# Altium project eps2_project.prjpcb (part 5 of 9)

## Sheet 7_dc_dc_3v3_eps_ttc.schdoc: EPS/Beacon Step-Down Converter (3V3/2A)
size A4; Designed by: Andre M. P. Mattos; ProjectRevision: v0.3; Organization: UFSC; DocumentNumber: 9; Revision: v0.3; SheetNumber: 9; SheetTotal: 11
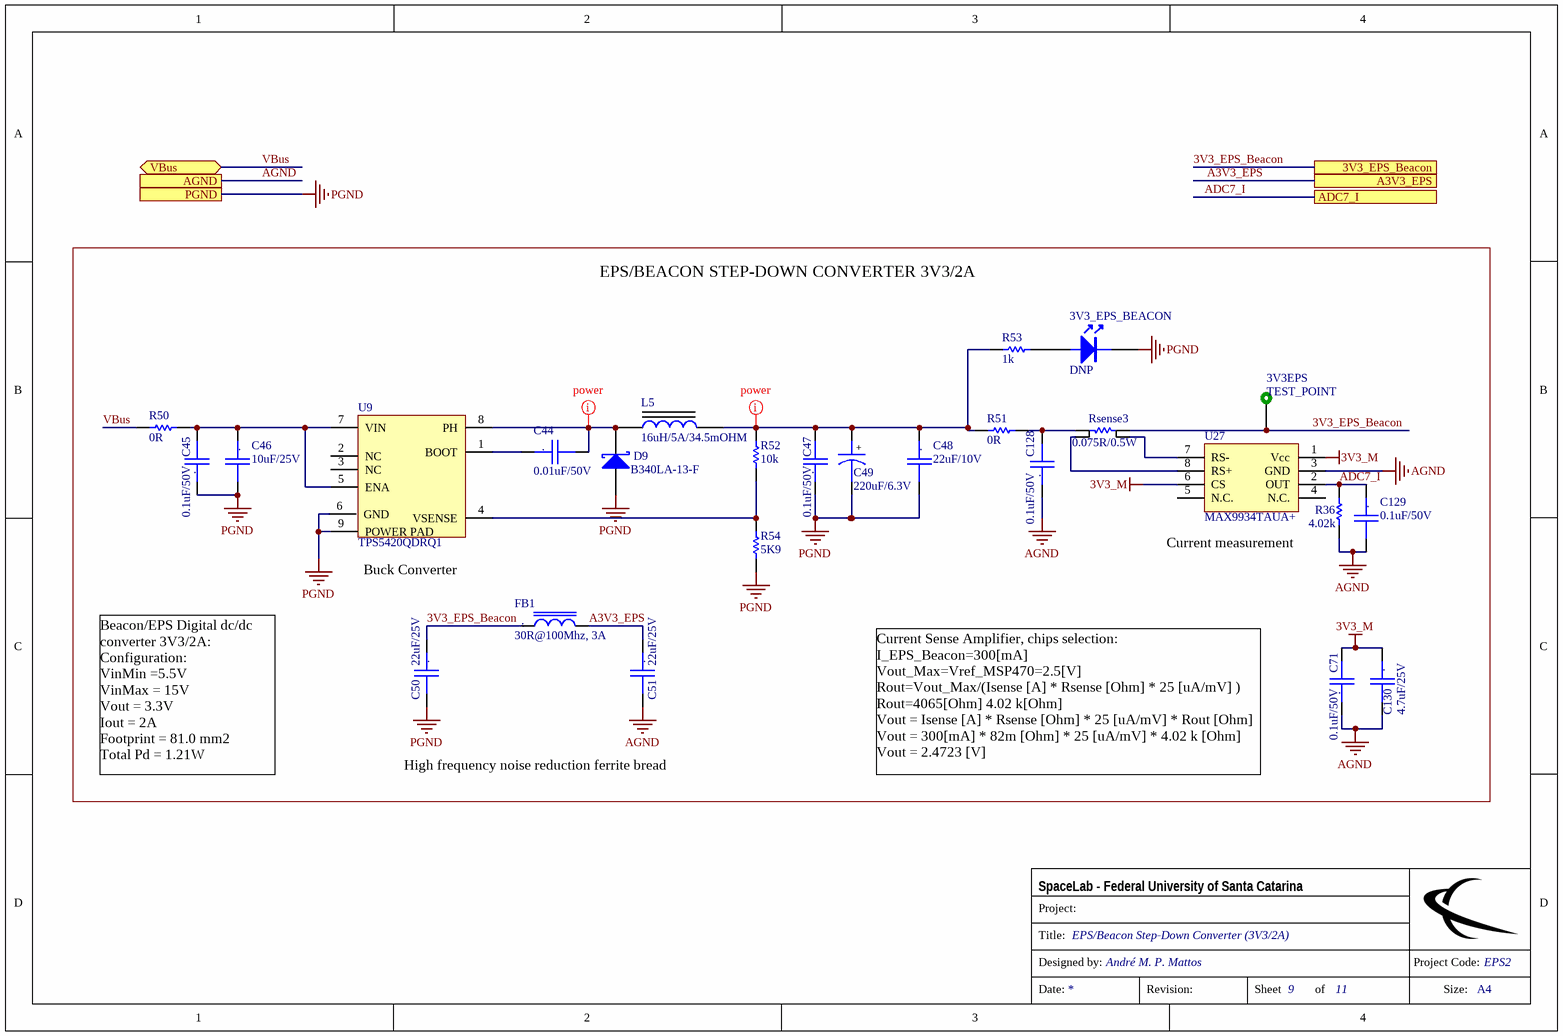
[diagram p6: 7_dc_dc_3v3_eps_ttc.schdoc]

### Parts
3V3_EPS_BEACON  DNP  [0603-LED]
3V3EPS  TEST_POINT  [TEST_POINT]  (no BOM)
C44  0.01uF/50V  [CC0805]
C45  0.1uF/50V  [CC0805]
C46  10uF/25V  [CC1206]
C47  0.1uF/50V  [CC0805]
C48  22uF/10V  [CC1206]
C49  220uF/6.3V  [cc1210]
C50  22uF/25V  [CC1210]
C51  22uF/25V  [CC1210]
C71  0.1uF/50V  [CC0603]
C128  0.1uF/50V  [CC0603]
C129  0.1uF/50V  [CC0603]
C130  4.7uF/25V  [CC0805]
D9  B340LA-13-F  [DO-214AC]
FB1  30R@100Mhz, 3A  [IND0805]
L5  16uH/5A/34.5mOHM  [IND_744325xxx]
R36  4.02k  [0805]
R50  0R  [1206]
R51  0R  [1206]
R52  10k  [0805]
R53  1k  [0603]
R54  5K9  [0805]
Rsense3  0.075R/0.5W  [1206 - ohmite]
U9  TPS5420QDRQ1  [SO8 Power PAD]
U27  MAX9934TAUA+  [MSOP-8]

### Ports
3V3_EPS_Beacon, A3V3_EPS, ADC7_I, AGND, PGND, VBus (bidir)

### Nets
3V3_EPS_Beacon: 3V3EPS.1 C50.1 FB1.1 Rsense3.2 ; port 3V3_EPS_Beacon
3V3_M: C71.2 C130.1 U27.1(Vcc) U27.6(CS)
A3V3_EPS: C51.1 FB1.2 ; port A3V3_EPS
AGND: C51.2 C71.1 C128.1 C129.2 C130.2 R36.1 U27.3(GND) ; port AGND
PGND: 3V3_EPS_BEACON.2(K) C45.1 C46.2 C47.1 C48.2 C49.2 C50.2 D9.2(A) R54.1 U9.6(GND) U9.9(POWER_PAD) ; port PGND
ADC7_I: C129.1 R36.2 U27.2(OUT) ; port ADC7_I
VBus: R50.2 ; port VBus
Net3V3_EPS_BEACON_1: 3V3_EPS_BEACON.1(A) R53.1
NetC44_1: C44.1 U9.1(BOOT)
NetC44_2: C44.2 D9.1(K) L5.1 U9.8(PH)
NetC45_2: C45.2 C46.1 R50.1 U9.5(ENA) U9.7(VIN)
NetC47_2: C47.2 C48.1 C49.1 L5.2 R51.2 R52.2 R53.2
NetC128_2: C128.2 R51.1 Rsense3.1
NetR52_1: R52.1 R54.2 U9.4(VSENSE)
NetRsense3_3: Rsense3.3 U27.8(RS+)
NetRsense3_4: Rsense3.4 U27.7(RS-)

Not connected (* = marked no-connect by the designer): U9 2(NC) 3(NC); U27 4(N.C.) 5(N.C.)

### Layout directives
net class power: NetC44_2, NetC47_2

### Notes on the sheet
- EPS/BEACON STEP-DOWN CONVERTER 3V3/2A
- (near U9) Buck Converter
- Current measurement
- Beacon/EPS Digital dc/dc converter 3V3/2A:
  Configuration:
  VinMin =5.5V
  VinMax = 15V
  Vout = 3.3V
  Iout = 2A
  Footprint = 81.0 mm2
  Total Pd = 1.21W
- High frequency noise reduction ferrite bread
- Current Sense Amplifier, chips selection:
  I_EPS_Beacon=300[mA]
  Vout_Max=Vref_MSP470=2.5[V]
  Rout=Vout_Max/(Isense [A] * Rsense [Ohm] * 25 [uA/mV] )
  Rout=4065[Ohm] 4.02 k[Ohm]
  Vout = Isense [A] * Rsense [Ohm] * 25 [uA/mV] * Rout [Ohm]
  Vout = 300[mA] * 82m [Ohm] * 25 [uA/mV] * 4.02 k [Ohm]
  Vout = 2.4723 [V]
- Project:
- SpaceLab - Federal University of Santa Catarina
- Title:
- Designed by:
- Project Code:
- Date:
- Revision:
- Sheet
- of
- Size:
- A4
- (in symbol Cap_Cer_X7R_0.1uF_50V_0603) .
- (in symbol Cap_Cer_X7R_0.01uF_50V_0805) .
- (in symbol Cap_Cer_X7R_0.1uF_50V_0805) .
- (in symbol Cap_Cer_X7R_4.7uF_25V_0805) .
- (in symbol Cap_Cer_X7R_10uF_25V_1206) .
- (in symbol Cap_Cer_X7R_22uF_10V_1206) .
- (in symbol Cap_Cer_X7R_22uF_25V_1210) .
- (in symbol Cap_Tant_SMD_220uF_6.3V_1210) +
- (in symbol FB_30R_3A_100MHz_0805) .

### Library data of the parts
3V3_EPS_BEACON = LED/G_0603: SMD Green LED; Partnumber: 150060VS75000; Manufacturer: Wurth Electronics; Dominant Wavelength: 570nm; Forward Current: 30mA; Forward Voltage: 2V; Lens Style: Clear,Rectangular; Luminous Intensity: 40mcd; Test Current: 20mA; Viewing Angle: 140°; NCM: 8541.40.21; Case/Package: 0603; Case Code (Imperial): 0603; Case Code (Metric): 1608; Color: Green; ComponentLink1Description: https://katalog.we-online.de/led/datasheet/150060VS75000.pdf?src-supplier=Digi-Key; ComponentLink1URL: https://katalog.we-online.de/led/datasheet/150060VS75000.pdf?src-supplier=Digi-Key; Height: 0.7mm; Length: 1.6mm; Manufacturer Part Number: 150060VS75000; Max Operating Temperature: 85°C; Min Operating Temperature: -40°C; Mount: Surface Mount; Number of Pins: 2; Package Quantity: 1; Packaging: Tape and Reel; Pricing 1: 1=0.14, 10=0.138, 25=0.138, 50=0.129, 100=0.11, 250=0.11 (USD); Pricing 2: 1=0.14, 50=0.133, 100=0.114, 500=0.099 (USD); REACH SVHC: Unknown; Stock 1: 16336; Stock 2: 31910; Supplier 1: Mouser; Supplier 2: Digi-Key; Supplier Part Number 1: 710-150060VS75000; Supplier Part Number 2: 732-4980-1-ND; Wavelength: 570nm; Width: 0.8mm
3V3EPS = TEST_POINT: Test point
C44 = Cap_Cer_X7R_0.01uF_50V_0805: CAP CER 0.01uF 50V 10% X7R 0805; Partnumber: 08055C103KAT4A; Manufacturer: Kyocera AVX; Capacitance: 10nF; NCM: 8532.24.10; Case/Package: 0805; Case Code (Imperial): 0805; Case Code (Metric): 2012; ComponentLink1Description: http://www.mouser.com/ds/2/40/X7RDielectric-777024.pdf?src-supplier=Mouser; ComponentLink1URL: http://www.mouser.com/ds/2/40/X7RDielectric-777024.pdf?src-supplier=Mouser; ComponentLink2Description: http://www.avx.com/docs/Catalogs/cx7r.pdf?src-supplier=Future+Electronics; ComponentLink2URL: http://www.avx.com/docs/Catalogs/cx7r.pdf?src-supplier=Future+Electronics; Depth: 1.25mm; Dielectric: X7R; Height: 0.94mm; Lead Free: Lead Free; Length: 2.01mm; Manufacturer Part Number: 08055C103KAT4A; Max Operating Temperature: 125°C; Min Operating Temperature: -55°C; Mount: Surface Mount; Number of Pins: 2; Packaging: Tape and Reel; Pricing 1: 1=0.12, 10=0.085, 100=0.04, 500=0.028, 1000=0.023, 2500=0.018 (USD); Pricing 2: 1=0.13, 10=0.09, 50=0.0508, 100=0.0421, 500=0.02952, 1000=0.02444, 2500=0.02275, 5000=0.02081 (USD); Radiation Hardening: No; Stock 1: 88198; Stock 2: 515319; Supplier 1: Mouser; Supplier 2: Digi-Key; Supplier Part Number 1: 581-08055C103KAT4A; Supplier Part Number 2: 478-10687-1-ND; Termination: SMD/SMT; Tolerance: 10%; Voltage: 50V; Voltage Rating (DC): 50V; Voltage Rating: 50V; Weight: 0.000194oz; Width: 1.25mm
C45 C47 = Cap_Cer_X7R_0.1uF_50V_0805: CAP CER 0.1UF 50V 10% X7R 0805; Partnumber: CC0805KRX7R9BB104; Manufacturer: Yageo; Capacitance: 100nF; Insulation Resistance: 100GR; Material: Ceramic; Case/Package: 0805; Case Code (Imperial): 0805; Case Code (Metric): 2012; ComponentLink1Description: http://www.yageo.com/documents/recent/UPY-GPHC_X7R_6.3V-to-50V_8.pdf?src-supplier=Avnet; ComponentLink1URL: http://www.yageo.com/documents/recent/UPY-GPHC_X7R_6.3V-to-50V_8.pdf?src-supplier=Avnet; ComponentLink2Description: http://www.farnell.com/datasheets/1489800.pdf?src-supplier=Element14; ComponentLink2URL: http://www.farnell.com/datasheets/1489800.pdf?src-supplier=Element14; ComponentLink3Description: http://www.yageo.com/documents/recent/UPY-GPHC_X7R_6.3V-to-50V_18.pdf?src-supplier=Digi-Key; ComponentLink3URL: http://www.yageo.com/documents/recent/UPY-GPHC_X7R_6.3V-to-50V_18.pdf?src-supplier=Digi-Key; ComponentLink4Description: http://www.farnell.com/datasheets/2167236.pdf?src-supplier=Element14; ComponentLink4URL: http://www.farnell.com/datasheets/2167236.pdf?src-supplier=Element14; ComponentLink5Description: http://www.yageo.com/documents/recent/UPY-GPHC_X7R_6.3V-to-50V_8.pdf?src-supplier=Avnet+Europe; ComponentLink5URL: http://www.yageo.com/documents/recent/UPY-GPHC_X7R_6.3V-to-50V_8.pdf?src-supplier=Avnet+Europe; ComponentLink6Description: http://www.produktinfo.conrad.com/datenblaetter/425000-449999/445210-da-01-en-KERKO_CHIP_0805_X7R_0_1uF_10Proz_50VG.pdf?src-supplier=Conrad; ComponentLink6URL: http://www.produktinfo.conrad.com/datenblaetter/425000-449999/445210-da-01-en-KERKO_CHIP_0805_X7R_0_1uF_10Proz_50VG.pdf?src-supplier=Conrad; Depth: 1.25mm; Dielectric: X7R; Halogen Free: Halogen Free; Height: 0.85mm; Lead Free: Lead Free; Length: 2mm; Manufacturer Part Number: CC0805KRX7R9BB104; Max Operating Temperature: 125°C; Min Operating Temperature: -55°C; Mount: Surface Mount; Number of Pins: 2; Package Quantity: 1; Packaging: Tape and Reel; Pricing 1: 1=0.12, 10=0.087, 100=0.028, 1000=0.023, 4000=0.018, 8000=0.017 (USD); Pricing 2: 1=0.12, 10=0.088, 50=0.05, 100=0.0414, 500=0.02906, 1000=0.02405 (USD); Radiation Hardening: No; REACH SVHC: No SVHC; Stock 1: 3904445; Stock 2: 544494; Supplier 1: Mouser; Supplier 2: Digi-Key; Supplier Part Number 1: 603-CC805KRX7R9BB104; Supplier Part Number 2: 311-1140-1-ND; Termination: SMD/SMT; Thickness: 0.033inch; Tolerance: 10%; Voltage: 50V; Voltage Rating: 50V; Width: 0.049inch
C46 = Cap_Cer_X7R_10uF_25V_1206: CAP CER 10uF 25V 10% X7R 1206; Partnumber: GRM31CR71E106KA12L; Manufacturer: Murata; Material: Ceramic; NCM: 8532.24.10; Capacitance: 10uF; Case/Package: 1206; Case Code (Imperial): 1206; Case Code (Metric): 3216; ComponentLink1Description: http://www.mouser.com/ds/2/281/c02e-2905.pdf?src-supplier=Mouser; ComponentLink1URL: http://www.mouser.com/ds/2/281/c02e-2905.pdf?src-supplier=Mouser; ComponentLink2Description: http://www.farnell.com/datasheets/415311.pdf?src-supplier=Element14; ComponentLink2URL: http://www.farnell.com/datasheets/415311.pdf?src-supplier=Element14; ComponentLink3Description: http://www.farnell.com/datasheets/2048746.pdf?src-supplier=Element14; ComponentLink3URL: http://www.farnell.com/datasheets/2048746.pdf?src-supplier=Element14; ComponentLink4Description: http://uk.rs-online.com/webdocs/13d2/0900766b813d2ca8.pdf?src-supplier=RSComponents; ComponentLink4URL: http://uk.rs-online.com/webdocs/13d2/0900766b813d2ca8.pdf?src-supplier=RSComponents; ComponentLink5Description: http://search.murata.co.jp/Ceramy/image/img/A01X/partnumbering_e_01.pdf?src-supplier=Future+Electronics; ComponentLink5URL: http://search.murata.co.jp/Ceramy/image/img/A01X/partnumbering_e_01.pdf?src-supplier=Future+Electronics; ComponentLink6Description: https://www.distrelec.biz/Web/Downloads/_t/ds/murata_MLCC_eng_tds.pdf?mime=application%2Fpdf&src-supplier=Distrelec; ComponentLink6URL: https://www.distrelec.biz/Web/Downloads/_t/ds/murata_MLCC_eng_tds.pdf?mime=application%2Fpdf&src-supplier=Distrelec; ComponentLink7Description: https://www.murata.com/~/media/webrenewal/support/library/catalog/products/capacitor/mlcc/c02e.ashx?la=en-us&src-supplier=Digi-Key; ComponentLink7URL: https://www.murata.com/~/media/webrenewal/support/library/catalog/products/capacitor/mlcc/c02e.ashx?la=en-us&src-supplier=Digi-Key; ComponentLink8Description: http://components.arrow.com/part/dataview/46271255S8319800N2606?src-supplier=Arrow; ComponentLink8URL: http://components.arrow.com/part/dataview/46271255S8319800N2606?src-supplier=Arrow; ComponentLink9Description: http://www.farnell.com/datasheets/415311.pdf?src-supplier=Farnell; ComponentLink9URL: http://www.farnell.com/datasheets/415311.pdf?src-supplier=Farnell; ComponentLink10Description: http://www.produktinfo.conrad.com/datenblaetter/450000-474999/454935-da-01-en-VS_KONDENSATOR_1206.pdf?src-supplier=Conrad; ComponentLink10URL: http://www.produktinfo.conrad.com/datenblaetter/450000-474999/454935-da-01-en-VS_KONDENSATOR_1206.pdf?src-supplier=Conrad; ComponentLink11Description: http://www.produktinfo.conrad.com/datenblaetter/450000-474999/451104-da-01-de-VS_CHIP_KOND_1206_10_0_UF_10Pr_25_0V_X7R.pdf?src-supplier=Conrad; ComponentLink11URL: http://www.produktinfo.conrad.com/datenblaetter/450000-474999/451104-da-01-de-VS_CHIP_KOND_1206_10_0_UF_10Pr_25_0V_X7R.pdf?src-supplier=Conrad; Depth: 1.6mm; Dielectric: X7R; Height: 1.6mm; Lead Free: Lead Free; Length: 3.2mm; Manufacturer Part Number: GRM31CR71E106KA12L; Max Operating Temperature: 125°C; Min Operating Temperature: -55°C; Mount: Surface Mount; Number of Pins: 2; Package Quantity: 1; Packaging: Tape and Reel; Pricing 1: 1=0.83, 10=0.627, 100=0.448, 250=0.434, 500=0.347, 1000=0.299 (USD); Pricing 2: 1=0.88, 10=0.646, 50=0.517, 100=0.4431, 500=0.35082, 1000=0.29543 (USD); Radiation Hardening: No; REACH SVHC: No SVHC; Stock 1: 131052; Stock 2: 1515422; Supplier 1: Mouser; Supplier 2: Digi-Key; Supplier Part Number 1: 81-GRM31CR71E106KA12; Supplier Part Number 2: 490-6518-1-ND; Termination: SMD/SMT; Thickness: 0.071inch; Tolerance: 10%; Voltage: 25V; Voltage Rating (DC): 25V; Voltage Rating: 25V; Width: 1.6mm
C48 = Cap_Cer_X7R_22uF_10V_1206: CAP CER 22uF 10V 10% X7R 1206; Partnumber: GRM31CR71A226KE15L; Manufacturer: Murata; Material: Ceramic; NCM: 8532.24.10; Capacitance: 22uF; Case/Package: 1206; Case Code (Imperial): 1206; Case Code (Metric): 3216; ComponentLink1Description: http://components.arrow.com/part/dataview/46868660S8337524N2606?src-supplier=Arrow; ComponentLink1URL: http://components.arrow.com/part/dataview/46868660S8337524N2606?src-supplier=Arrow; ComponentLink2Description: http://uk.rs-online.com/webdocs/1423/0900766b81423c84.pdf?src-supplier=RSComponents; ComponentLink2URL: http://uk.rs-online.com/webdocs/1423/0900766b81423c84.pdf?src-supplier=RSComponents; ComponentLink3Description: https://www.murata.com/~/media/webrenewal/support/library/catalog/products/capacitor/mlcc/c02e.ashx?la=en-us&src-supplier=Digi-Key; ComponentLink3URL: https://www.murata.com/~/media/webrenewal/support/library/catalog/products/capacitor/mlcc/c02e.ashx?la=en-us&src-supplier=Digi-Key; ComponentLink4Description: http://www.farnell.com/datasheets/2048963.pdf?src-supplier=Farnell; ComponentLink4URL: http://www.farnell.com/datasheets/2048963.pdf?src-supplier=Farnell; ComponentLink5Description: http://www.farnell.com/datasheets/2048963.pdf?src-supplier=Element14; ComponentLink5URL: http://www.farnell.com/datasheets/2048963.pdf?src-supplier=Element14; ComponentLink6Description: http://psearch.en.murata.com/capacitor/product/GRM31CR71A226KE15%23.pdf?src-supplier=Avnet; ComponentLink6URL: http://psearch.en.murata.com/capacitor/product/GRM31CR71A226KE15%23.pdf?src-supplier=Avnet; ComponentLink7Description: http://psearch.murata.com/capacitor/product/GRM31CR71A226KE15%23.pdf?src-supplier=Avnet; ComponentLink7URL: http://psearch.murata.com/capacitor/product/GRM31CR71A226KE15%23.pdf?src-supplier=Avnet; ComponentLink8Description: https://www.distrelec.biz/Web/Downloads/_t/ds/murata_MLCC_eng_tds.pdf?mime=application%2Fpdf&src-supplier=Distrelec; ComponentLink8URL: https://www.distrelec.biz/Web/Downloads/_t/ds/murata_MLCC_eng_tds.pdf?mime=application%2Fpdf&src-supplier=Distrelec; ComponentLink9Description: http://psearch.murata.com/capacitor/product/GRM31CR71A226KE15%23.pdf?src-supplier=Future+Electronics; ComponentLink9URL: http://psearch.murata.com/capacitor/product/GRM31CR71A226KE15%23.pdf?src-supplier=Future+Electronics; ComponentLink10Description: http://www.produktinfo.conrad.com/datenblaetter/450000-474999/451412-da-01-de-VS_KONDENS_GRM31_CR71A_226KE15L.pdf?src-supplier=Conrad; ComponentLink10URL: http://www.produktinfo.conrad.com/datenblaetter/450000-474999/451412-da-01-de-VS_KONDENS_GRM31_CR71A_226KE15L.pdf?src-supplier=Conrad; ComponentLink11Description: http://www.produktinfo.conrad.com/datenblaetter/450000-474999/451120-da-01-de-VS_CHIP_KOND_1206_22_0_UF_10Pr_10_0V_X7R.pdf?src-supplier=Conrad; ComponentLink11URL: http://www.produktinfo.conrad.com/datenblaetter/450000-474999/451120-da-01-de-VS_CHIP_KOND_1206_22_0_UF_10Pr_10_0V_X7R.pdf?src-supplier=Conrad; Depth: 1.6mm; Dielectric: X7R; Height: 1.6mm; Lead Free: Lead Free; Length: 3.2mm; Manufacturer Part Number: GRM31CR71A226KE15L; Max Operating Temperature: 125°C; Min Operating Temperature: -55°C; Mount: Surface Mount; Package Quantity: 1; Packaging: Tape and Reel; Pricing 1: 1=1.11, 10=0.921, 100=0.697, 250=0.677, 500=0.527, 1000=0.464 (USD); Pricing 2: 1=1.13, 10=0.889, 50=0.7702, 100=0.6666, 500=0.50362, 1000=0.44438 (USD); Radiation Hardening: No; REACH SVHC: No SVHC; Stock 1: 113879; Stock 2: 339340; Supplier 1: Mouser; Supplier 2: Digi-Key; Supplier Part Number 1: 81-GRM31CR71A226K15L; Supplier Part Number 2: 490-5309-1-ND; Termination: SMD/SMT; Thickness: 0.071inch; Tolerance: 10%; Voltage: 10V; Voltage Rating (DC): 10V; Voltage Rating: 10V; Width: 0.063inch
C49 = Cap_Tant_SMD_220uF_6.3V_1210: CAP Tantalum 220uF 6.3V 20% 1210; Partnumber: 6TPE220MAZB; Manufacturer: Panasonic; Dissipation Factor: 10%; ESR (Equivalent Series Resistance): 35mR; Leakage Current: 138.6uA; Polarity: Polar; Ripple Current: 1.4A; NCM: 8532.21.11; Capacitance: 220uF; Case/Package: Molded; Case Code (Imperial): 1411; Case Code (Metric): 3528; ComponentLink1Description: http://www.farnell.com/datasheets/2059638.pdf?src-supplier=Element14; ComponentLink1URL: http://www.farnell.com/datasheets/2059638.pdf?src-supplier=Element14; ComponentLink2Description: https://www.verical.com/server-webapp/html/getDatasheet?partID=733772&src-supplier=Verical; ComponentLink2URL: https://www.verical.com/server-webapp/html/getDatasheet?partID=733772&src-supplier=Verical; ComponentLink3Description: https://www.distrelec.biz/Web/Downloads/_t/ds/tpe-series_eng_tds.pdf?mime=application%2Fpdf&src-supplier=Distrelec; ComponentLink3URL: https://www.distrelec.biz/Web/Downloads/_t/ds/tpe-series_eng_tds.pdf?mime=application%2Fpdf&src-supplier=Distrelec; ComponentLink4Description: http://industrial.panasonic.com/www-data/pdf/AAA8000/AAA8000CE5.pdf?src-supplier=Avnet; ComponentLink4URL: http://industrial.panasonic.com/www-data/pdf/AAA8000/AAA8000CE5.pdf?src-supplier=Avnet; ComponentLink5Description: http://www.mouser.com/ds/2/315/AAA8000C36-947358.pdf?src-supplier=Mouser; ComponentLink5URL: http://www.mouser.com/ds/2/315/AAA8000C36-947358.pdf?src-supplier=Mouser; Depth: 2.8mm; Features: General Purpose; Height - Seated (Max): 0.079inch; Height: 1.9mm; Lead Free: Lead Free; Length: 3.5mm; Manufacturer Part Number: 6TPE220MAZB; Max Operating Temperature: 105°C; Min Operating Temperature: -55°C; Mount: Surface Mount; Number of Pins: 2; Package Quantity: 2000; Packaging: Tape and Reel; Pricing 1: 1=1.63, 10=1.28, 100=0.964, 500=0.728, 1000=0.642, 2000=0.521 (USD); Pricing 2: 1=1.56, 10=1.23, 50=1.0656, 100=0.9222, 500=0.69676, 1000=0.61479 (USD); Radiation Hardening: No; REACH SVHC: No SVHC; Stock 1: 11237; Stock 2: 59078; Supplier 1: Mouser; Supplier 2: Digi-Key; Supplier Part Number 1: 667-6TPE220MAZB; Supplier Part Number 2: P16245CT-ND; Termination: SMD/SMT; Tolerance: 20%; Voltage: 6.3V; Voltage Rating (DC): 6.3V; Voltage Rating: 6.3V; Width: 0.11inch
C50 C51 = Cap_Cer_X7R_22uF_25V_1210: CAP CER 22uF 25V 10% X7R 1210; Partnumber: GRM32ER71E226KE15L; Manufacturer: Murata; Material: Ceramic; Capacitance: 22uF; Case/Package: 1210; Case Code (Imperial): 1210; Case Code (Metric): 3225; ComponentLink1Description: http://www.farnell.com/datasheets/2048964.pdf?src-supplier=Farnell; ComponentLink1URL: http://www.farnell.com/datasheets/2048964.pdf?src-supplier=Farnell; ComponentLink2Description: http://psearch.murata.com/capacitor/product/GRM32ER71E226KE15%23.pdf?src-supplier=Future+Electronics; ComponentLink2URL: http://psearch.murata.com/capacitor/product/GRM32ER71E226KE15%23.pdf?src-supplier=Future+Electronics; ComponentLink3Description: https://www.murata.com/~/media/webrenewal/support/library/catalog/products/capacitor/mlcc/c02e.ashx?la=en-us&src-supplier=Digi-Key; ComponentLink3URL: https://www.murata.com/~/media/webrenewal/support/library/catalog/products/capacitor/mlcc/c02e.ashx?la=en-us&src-supplier=Digi-Key; ComponentLink4Description: http://components.arrow.com/part/dataview/47905228S8888111N2606?src-supplier=Arrow; ComponentLink4URL: http://components.arrow.com/part/dataview/47905228S8888111N2606?src-supplier=Arrow; ComponentLink5Description: http://www.farnell.com/datasheets/2048964.pdf?src-supplier=Element14; ComponentLink5URL: http://www.farnell.com/datasheets/2048964.pdf?src-supplier=Element14; ComponentLink6Description: http://uk.rs-online.com/webdocs/13d2/0900766b813d2caa.pdf?src-supplier=RSComponents; ComponentLink6URL: http://uk.rs-online.com/webdocs/13d2/0900766b813d2caa.pdf?src-supplier=RSComponents; ComponentLink7Description: https://produktinfo.conrad.com/datenblaetter/450000-474999/451826-da-01-de-VS_KONDENS_GRM32_ER71E_226KE15L.pdf?src-supplier=Conrad; ComponentLink7URL: https://produktinfo.conrad.com/datenblaetter/450000-474999/451826-da-01-de-VS_KONDENS_GRM32_ER71E_226KE15L.pdf?src-supplier=Conrad; Depth: 2.5mm; Dielectric: X7R; Height: 2.5mm; Lead Free: Lead Free; Length: 3.2mm; Manufacturer Part Number: GRM32ER71E226KE15L; Max Operating Temperature: 125°C; Min Operating Temperature: -55°C; Mount: Surface Mount; Number of Pins: 2; Package Quantity: 1; Packaging: Tape and Reel; Pricing 1: 1=1.96, 10=1.54, 25=1.54, 100=1.15, 250=1.15, 500=0.876 (USD); Pricing 2: 1=1.87, 10=1.479, 50=1.2816, 100=1.1091, 500=0.83802 (USD); Radiation Hardening: No; REACH SVHC: No SVHC; Stock 1: 169862; Stock 2: 0; Supplier 1: Mouser; Supplier 2: Digi-Key; Supplier Part Number 1: 81-GRM32ER71E226KE5L; Supplier Part Number 2: 490-5313-1-ND; Termination: SMD/SMT; Thickness: 0.106inch; Tolerance: 10%; Voltage: 25V; Voltage Rating (DC): 25V; Voltage Rating: 25V; Width: 0.098inch
C71 C128 C129 = Cap_Cer_X7R_0.1uF_50V_0603: CAP CER 0.1UF 50V 10% X7R 0603; Partnumber: CC0603KPX7R9BB104; Manufacturer: Yageo; Capacitance: 100nF; Case/Package: 0603; Case Code (Imperial): 0603; Case Code (Metric): 1608; ComponentLink1Description: https://www.verical.com/server-webapp/html/getDatasheet?partID=653026&src-supplier=Verical; ComponentLink1URL: https://www.verical.com/server-webapp/html/getDatasheet?partID=653026&src-supplier=Verical; Composition: Ceramic; Depth: 0.8mm; Dielectric: X7R; Halogen Free: Halogen Free; Height: 0.8mm; Lead Free: Lead Free; Length: 1.6mm; Manufacturer Part Number: CC0603KPX7R9BB104; Max Operating Temperature: 125°C; Min Operating Temperature: -55°C; Mount: Surface Mount; Number of Pins: 2; Packaging: Tape and Reel; Pricing 1: 1=0.1, 10=0.065, 100=0.02, 1000=0.016, 2500=0.013, 10000=0.01 (USD); Pricing 2: 1=0.1, 10=0.066, 50=0.036, 100=0.0293, 500=0.02094, 1000=0.01646, 2500=0.01496, 5000=0.01376 (USD); Radiation Hardening: No; Stock 1: 5712768; Stock 2: 0; Supplier 1: Mouser; Supplier 2: Digi-Key; Supplier Part Number 1: 603-CC603KPX7R9BB104; Supplier Part Number 2: 311-3567-1-ND; Termination: SMD/SMT; Thickness: 0.035inch; Tolerance: 10%; Voltage Rating (DC): 50V; Voltage Rating: 50V; Weight: 7.1E-05oz; Width: 0.031inch
C130 = Cap_Cer_X7R_4.7uF_25V_0805: CAP CER 4.7uF 25V 10% X7R 0805; Partnumber: CC0805KKX7R8BB475; Manufacturer: Yageo; NCM: 8532.24.10; Capacitance: 4.7uF; Case/Package: 0805; Case Code (Imperial): 0805; Case Code (Metric): 2012; ComponentLink1Description: http://www.mouser.com/ds/2/447/Yageo_UPY-GP_NP0_16V-to-50V_9-358835.pdf?src-supplier=Mouser; ComponentLink1URL: http://www.mouser.com/ds/2/447/Yageo_UPY-GP_NP0_16V-to-50V_9-358835.pdf?src-supplier=Mouser; ComponentLink2Description: http://www.yageo.com/documents/recent/UPY-GPHC_X7R_6.3V-to-50V_18.pdf?src-supplier=Digi-Key; ComponentLink2URL: http://www.yageo.com/documents/recent/UPY-GPHC_X7R_6.3V-to-50V_18.pdf?src-supplier=Digi-Key; Dielectric: X7R; Halogen Free: Halogen Free; Lead Free: Lead Free; Length: 0.079inch; Manufacturer Part Number: CC0805KKX7R8BB475; Max Operating Temperature: 125°C; Min Operating Temperature: -55°C; Mount: Surface Mount; Package Quantity: 3000; Packaging: Tape and Reel; Pricing 1: 1=0.43, 10=0.25, 100=0.139, 1000=0.126, 3000=0.089, 9000=0.086 (USD); Pricing 2: 1=0.47, 10=0.327, 50=0.2288, 100=0.1962, 500=0.14714, 1000=0.12425 (USD); Stock 1: 121; Stock 2: 672; Supplier 1: Mouser; Supplier 2: Digi-Key; Supplier Part Number 1: 603-CC805KKX7R8BB475; Supplier Part Number 2: 311-1885-1-ND; Termination: SMD/SMT; Thickness: 0.057inch; Tolerance: 10%; Voltage Rating (DC): 25V; Voltage Rating: 25V; Weight: 0.000194oz; Width: 0.049inch
D9 = DIODE_SCHOTTKY_40V_3A_B340LA-13-F: DIODE SCHOTTKY 40V 3A B340LA-13-F; Manufacturer: Diodes; Capacitance: 180pF; Element Configuration: Single; Forward Voltage: 450mV; Max Forward Surge Current (Ifsm): 70A; Peak Reverse Current: 2mA; Polarity: Standard; NCM: 8541.10.29; Partnumber: B340LA-13-F; Average Rectified Current: 3A; Case/Package: SMA; ComponentLink1Description: http://www.farnell.com/datasheets/2238478.pdf?src-supplier=Element14; ComponentLink1URL: http://www.farnell.com/datasheets/2238478.pdf?src-supplier=Element14; ComponentLink2Description: http://www.diodes.com/datasheets/ds30240.pdf?src-supplier=Future+Electronics; ComponentLink2URL: http://www.diodes.com/datasheets/ds30240.pdf?src-supplier=Future+Electronics; ComponentLink3Description: http://www.jameco.com/Jameco/Products/ProdDS/1538881.pdf?src-supplier=Jameco; ComponentLink3URL: http://www.jameco.com/Jameco/Products/ProdDS/1538881.pdf?src-supplier=Jameco; ComponentLink4Description: https://www.diodes.com/assets/Datasheets/ds30240.pdf?src-supplier=Digi-Key; ComponentLink4URL: https://www.diodes.com/assets/Datasheets/ds30240.pdf?src-supplier=Digi-Key; ComponentLink5Description: https://www.verical.com/server-webapp/html/getDatasheet?partID=256588&src-supplier=Verical; ComponentLink5URL: https://www.verical.com/server-webapp/html/getDatasheet?partID=256588&src-supplier=Verical; Current Rating: 3A; Forward Current: 3A; Height: 2.1mm; Lead Free: Lead Free; Length: 4.6mm; Manufacturer Part Number: B340LA-13-F; Max Operating Temperature: 125°C; Max Repetitive Reverse Voltage (Vrrm): 40V; Max Reverse Voltage (DC): 40V; Min Operating Temperature: -55°C; Mount: Surface Mount; Number of Pins: 2; Output Current: 3A; Package Quantity: 5000; Packaging: Tape and Reel; Peak Non-Repetitive Surge Current: 70A; Pricing 1: 1=0.51, 10=0.417, 100=0.255, 1000=0.197, 5000=0.168, 10000=0.168 (USD); Pricing 2: 1=0.4, 10=0.341, 25=0.318, 100=0.2363, 250=0.22452, 500=0.18452, 1000=0.14999, 2500=0.1409 (USD); Radiation Hardening: No; REACH SVHC: No SVHC; Stock 1: 21204; Stock 2: 96615; Supplier 1: Mouser; Supplier 2: Digi-Key; Supplier Part Number 1: 621-B340LA-F; Supplier Part Number 2: B340LA-FDICT-ND; Termination: SMD/SMT; Voltage Rating (DC): 40V; Weight: 0.002258oz; Width: 2.92mm
FB1 = FB_30R_3A_100MHz_0805: Ferrite Bead 30 OHM 3A 100MHz; Partnumber: BLM21PG300SN1D; Manufacturer: Murata; Current Rating: 4A; DC Resistance (DCR): 14mR; Impedance: 30R; Material: Steel,Ferrite; Number of Circuits: 1; Resistance: 15mR; Shielding: Unshielded; Tolerance: 25%; NCM: 8504.50.00; Case/Package: 0805; Case Code (Imperial): 0805; Case Code (Metric): 2012; ComponentLink1Description: http://uk.rs-online.com/webdocs/002e/0900766b8002e1f1.pdf?src-supplier=RSComponents; ComponentLink1URL: http://uk.rs-online.com/webdocs/002e/0900766b8002e1f1.pdf?src-supplier=RSComponents; ComponentLink2Description: https://www.murata.com/en-us/products/productdata/8796738977822/ENFA0005.pdf?src-supplier=Digi-Key; ComponentLink2URL: https://www.murata.com/en-us/products/productdata/8796738977822/ENFA0005.pdf?src-supplier=Digi-Key; ComponentLink3Description: http://search.murata.co.jp/Ceramy/image/img/PDF/ENG/L0110S0100BLM21P.pdf?src-supplier=Avnet+Europe; ComponentLink3URL: http://search.murata.co.jp/Ceramy/image/img/PDF/ENG/L0110S0100BLM21P.pdf?src-supplier=Avnet+Europe; ComponentLink4Description: http://search.murata.co.jp/Ceramy/image/img/PDF/ENG/L0110S0100BLM21P.pdf?src-supplier=Avnet; ComponentLink4URL: http://search.murata.co.jp/Ceramy/image/img/PDF/ENG/L0110S0100BLM21P.pdf?src-supplier=Avnet; ComponentLink5Description: http://www.murata.com/en-global/api/pdfdownloadapi?cate=luNoiseSupprFilteChipFerriBead&partno=BLM21PG300SN1%23&src-supplier=Future+Electronics; ComponentLink5URL: http://www.murata.com/en-global/api/pdfdownloadapi?cate=luNoiseSupprFilteChipFerriBead&partno=BLM21PG300SN1%23&src-supplier=Future+Electronics; ComponentLink6Description: http://www.jameco.com/Jameco/Products/ProdDS/1845339.pdf?src-supplier=Jameco; ComponentLink6URL: http://www.jameco.com/Jameco/Products/ProdDS/1845339.pdf?src-supplier=Jameco; ComponentLink7Description: http://www.farnell.com/datasheets/1756152.pdf?src-supplier=Element14; ComponentLink7URL: http://www.farnell.com/datasheets/1756152.pdf?src-supplier=Element14; ComponentLink8Description: http://www.produktinfo.conrad.com/datenblaetter/1100000-1199999/001172365-da-01-en-DROSSEL_0805_30R0_2_0X1_25MM_4000ST.pdf?src-supplier=Conrad; ComponentLink8URL: http://www.produktinfo.conrad.com/datenblaetter/1100000-1199999/001172365-da-01-en-DROSSEL_0805_30R0_2_0X1_25MM_4000ST.pdf?src-supplier=Conrad; Core Material: Ferrite; DC Current: 3A; Depth: 1.25mm; Frequency: 100MHz; Height: 0.85mm; Lead Free: Lead Free; Length: 2mm; Manufacturer Part Number: BLM21PG300SN1D; Max Current Rating: 4A; Max DC Current: 3A; Max Operating Temperature: 125°C; Military Standard: Not; Min Operating Temperature: -55°C; Number of Lines: 1; Number of Pins: 2; Package Quantity: 1; Packaging: Tape and Reel; Pricing 1: 1=0.11, 10=0.06, 100=0.041, 500=0.037, 1000=0.03, 4000=0.028 (USD); Pricing 2: 1=0.11, 10=0.093, 25=0.0724, 50=0.06, 100=0.0517, 250=0.04136, 500=0.03722, 1000=0.03102 (USD); Radiation Hardening: No; REACH SVHC: No SVHC; Stock 1: 86637; Stock 2: 46682; Supplier 1: Mouser; Supplier 2: Digi-Key; Supplier Part Number 1: 81-BLM21P300S; Supplier Part Number 2: 490-1052-1-ND; Termination: SMD/SMT; Test Frequency: 100MHz; Width: 1.25mm
L5 = IND_POWER_16uH_5A_35.5mR: INDUCTOR 16UH 5A SMD; Partnumber: 7443251600; Manufacturer: Wurth Electronics; DC Resistance (DCR): 34.5mR; Inductance Tolerance: 20%; Saturation Current: 6.5A; Self Resonant Frequency: 18MHz; Series Resistance: 34.5R; Shielding: Shielded; Test Frequency: 100kHz; NCM: 8504.50.00; Case/Package: Nonstandard; ComponentLink1Description: http://www.mouser.com/ds/2/445/7443251600-73993.pdf?src-supplier=Mouser; ComponentLink1URL: http://www.mouser.com/ds/2/445/7443251600-73993.pdf?src-supplier=Mouser; ComponentLink2Description: http://www.farnell.com/datasheets/1735799.pdf?src-supplier=Element14; ComponentLink2URL: http://www.farnell.com/datasheets/1735799.pdf?src-supplier=Element14; ComponentLink3Description: https://www.distrelec.biz/Web/Downloads/_t/ds/7443251600_eng_tds.pdf?mime=application%2Fpdf&src-supplier=Distrelec; ComponentLink3URL: https://www.distrelec.biz/Web/Downloads/_t/ds/7443251600_eng_tds.pdf?mime=application%2Fpdf&src-supplier=Distrelec; ComponentLink4Description: http://katalog.we-online.de/pbs/datasheet/7443251600.pdf?src-supplier=Digi-Key; ComponentLink4URL: http://katalog.we-online.de/pbs/datasheet/7443251600.pdf?src-supplier=Digi-Key; ComponentLink5Description: http://www.produktinfo.conrad.com/datenblaetter/1000000-1099999/001087469-da-01-ml-WE_HCI_SMD_HOCHSTROMIND_7443251600_de_en.pdf?src-supplier=Conrad; ComponentLink5URL: http://www.produktinfo.conrad.com/datenblaetter/1000000-1099999/001087469-da-01-ml-WE_HCI_SMD_HOCHSTROMIND_7443251600_de_en.pdf?src-supplier=Conrad; Composition: Wirewound; Current Rating: 5A; Height - Seated (Max): 0.197inch; Height: 4.7mm; Inductance: 16uH; Length: 0.413inch; Manufacturer Part Number: 7443251600; Max DC Current: 5A; Max Operating Temperature: 150°C; Min Operating Temperature: -40°C; Mount: Surface Mount; Package Quantity: 700; Packaging: Tape and Reel; Pricing 1: 1=4.01, 10=3.94, 25=3.94, 50=3.63, 100=3.48, 250=3.26 (USD); Pricing 2: 1=4.01, 10=3.931, 50=3.629, 100=3.478, 250=3.251 (USD); REACH SVHC: Unknown; RMS Current (Irms): 5A; Stock 1: 2659; Stock 2: 2913; Supplier 1: Mouser; Supplier 2: Digi-Key; Supplier Part Number 1: 710-7443251600; Supplier Part Number 2: 732-4180-1-ND; Termination: SMD/SMT; Tolerance: 20%; Width: 10.2mm
R36 = R4.02k_0.1%_1/8W_0805: RES 4.02k OHM 1/8W 0.1% 0805; Partnumber: ERA-6AEB4021V; Manufacturer: Panasonic; Max Power Dissipation: 125mW; Resistance: 4.02kR; Temperature Coefficient: 25ppm/°C; Voltage Rating (DC): 100V; NCM: 8533.21.20; Case/Package: 0805; Case Code (Imperial): 0805; Case Code (Metric): 2012; ComponentLink1Description: http://www.farnell.com/datasheets/485442.pdf?src-supplier=Farnell; ComponentLink1URL: http://www.farnell.com/datasheets/485442.pdf?src-supplier=Farnell; ComponentLink2Description: http://www.farnell.com/datasheets/485442.pdf?src-supplier=Element14; ComponentLink2URL: http://www.farnell.com/datasheets/485442.pdf?src-supplier=Element14; ComponentLink3Description: http://www.mouser.com/ds/2/315/AOA0000C237-1100991.pdf?src-supplier=Mouser; ComponentLink3URL: http://www.mouser.com/ds/2/315/AOA0000C237-1100991.pdf?src-supplier=Mouser; ComponentLink4Description: http://industrial.panasonic.com/www-data/pdf/AOA0000/AOA0000CE26.pdf?src-supplier=Avnet; ComponentLink4URL: http://industrial.panasonic.com/www-data/pdf/AOA0000/AOA0000CE26.pdf?src-supplier=Avnet; ComponentLink5Description: http://uk.rs-online.com/webdocs/0eb1/0900766b80eb1d8c.pdf?src-supplier=RSComponents; ComponentLink5URL: http://uk.rs-online.com/webdocs/0eb1/0900766b80eb1d8c.pdf?src-supplier=RSComponents; ComponentLink6Description: https://produktinfo.conrad.com/datenblaetter/450000-474999/458752-da-01-en-WIDERSTAND_0805_ERA.pdf?src-supplier=Conrad; ComponentLink6URL: https://produktinfo.conrad.com/datenblaetter/450000-474999/458752-da-01-en-WIDERSTAND_0805_ERA.pdf?src-supplier=Conrad; Composition: Metal Film,Thin Film; Contact Plating: Tin; Depth: 1.25mm; Features: Automotive AEC-Q200; Height: 0.5mm; Lead Free: Lead Free; Length: 2mm; Manufacturer Part Number: ERA-6AEB4021V; Max Operating Temperature: 155°C; Min Operating Temperature: -55°C; Mount: Surface Mount; Number of Pins: 2; Number of Terminations: 2; Package Quantity: 5000; Packaging: Tape and Reel; Power Rating: 125mW; Pricing 1: 1=0.36, 10=0.302, 100=0.118, 1000=0.045, 5000=0.037, 10000=0.034 (USD); Pricing 2: 1=0.34, 10=0.288, 100=0.1126, 1000=0.04712, 2500=0.0432 (USD); Radiation Hardening: No; REACH SVHC: No SVHC; Stock 1: 541; Stock 2: 9287; Supplier 1: Mouser; Supplier 2: Digi-Key; Supplier Part Number 1: 667-ERA-6AEB4021V; Supplier Part Number 2: P4.02KDACT-ND; Termination: Solder; Tolerance: 0.1%; Voltage Rating: 100V; Width: 1.25mm
R50 R51 = R0R_JUMPER_3/4W_1206: RES 0.0 OHM 3/4W JUMP 1206; Partnumber: HCJ1206ZT0R00; Manufacturer: Stackpole Electronics; Resistance: 0mR; Fitted: No (jumper resistor); Case/Package: 1206; Case Code (Imperial): 1206; Case Code (Metric): 3216; ComponentLink1Description: http://www.seielect.com/Catalog/SEI-HCJ.pdf?src-supplier=Avnet; ComponentLink1URL: http://www.seielect.com/Catalog/SEI-HCJ.pdf?src-supplier=Avnet; ComponentLink2Description: https://www.seielect.com/Catalog/SEI-HCJ.pdf?src-supplier=Avnet+Asia; ComponentLink2URL: https://www.seielect.com/Catalog/SEI-HCJ.pdf?src-supplier=Avnet+Asia; ComponentLink3Description: https://www.seielect.com/catalog/SEI-HCJ.pdf?src-supplier=Digi-Key; ComponentLink3URL: https://www.seielect.com/catalog/SEI-HCJ.pdf?src-supplier=Digi-Key; ComponentLink4Description: https://www.seielect.com/catalog/SEI-Packaging.pdf?src-supplier=Digi-Key; ComponentLink4URL: https://www.seielect.com/catalog/SEI-Packaging.pdf?src-supplier=Digi-Key; Features: Automotive AEC-Q200; Height: 0.026inch; Length: 0.122inch; Manufacturer Part Number: HCJ1206ZT0R00; Max Operating Temperature: 155°C; Min Operating Temperature: -55°C; Mount: Surface Mount; Number of Terminations: 2; Package Quantity: 5000; Packaging: Tape and Reel; Pricing 1: 1=0.5, 10=0.358, 25=0.2788, 50=0.236, 100=0.1859, 250=0.15732, 500=0.1287, 1000=0.1001 (USD); Radiation Hardening: No; Stock 1: 1958428; Supplier 1: Digi-Key; Supplier Part Number 1: HCJ1206ZT0R00CT-ND; Termination: Wraparound; Width: 0.061inch
R52 = R10k_1%_1/8W_0805: RES 10K OHM 1/8W 1%  0805; Partnumber: CRCW080510K0FKEA; Manufacturer: Vishay; Power Rating: 125mW; Resistance: 10kR; Temperature Coefficient: 100ppm/°C; Voltage Rating (DC): 150V; NCM: 8533.21.20; Case/Package: 0805; Case Code (Imperial): 0805; Case Code (Metric): 2012; ComponentLink1Description: http://www.mouser.com/ds/2/427/dcrcwe3-109170.pdf?src-supplier=Mouser; ComponentLink1URL: http://www.mouser.com/ds/2/427/dcrcwe3-109170.pdf?src-supplier=Mouser; ComponentLink2Description: http://uk.rs-online.com/webdocs/0d98/0900766b80d98b26.pdf?src-supplier=RSComponents; ComponentLink2URL: http://uk.rs-online.com/webdocs/0d98/0900766b80d98b26.pdf?src-supplier=RSComponents; ComponentLink3Description: http://www.alliedelec.com/m/d/0c934d6939ccefa68dbe0b96d821c8cf.pdf?src-supplier=Allied+Electronics; ComponentLink3URL: http://www.alliedelec.com/m/d/0c934d6939ccefa68dbe0b96d821c8cf.pdf?src-supplier=Allied+Electronics; ComponentLink4Description: http://www.vishay.com/docs/20035/dcrcwe3.pdf?src-supplier=Avnet+Asia; ComponentLink4URL: http://www.vishay.com/docs/20035/dcrcwe3.pdf?src-supplier=Avnet+Asia; ComponentLink5Description: http://www.vishay.com/docs/20035/dcrcwe3.pdf?src-supplier=Avnet+Europe; ComponentLink5URL: http://www.vishay.com/docs/20035/dcrcwe3.pdf?src-supplier=Avnet+Europe; ComponentLink6Description: http://www.farnell.com/datasheets/2310790.pdf?src-supplier=Element14; ComponentLink6URL: http://www.farnell.com/datasheets/2310790.pdf?src-supplier=Element14; ComponentLink7Description: http://www.vishay.com/docs/20035/dcrcwe3.pdf?src-supplier=Avnet; ComponentLink7URL: http://www.vishay.com/docs/20035/dcrcwe3.pdf?src-supplier=Avnet; ComponentLink8Description: http://www.vishay.com/docs/20035/dcrcwe3.pdf?src-supplier=Future+Electronics; ComponentLink8URL: http://www.vishay.com/docs/20035/dcrcwe3.pdf?src-supplier=Future+Electronics; Composition: Thick Film; Contact Plating: Tin; Depth: 1.25mm; Height: 0.45mm; Lead Free: Lead Free; Length: 2mm; Manufacturer Part Number: CRCW080510K0FKEA; Max Operating Temperature: 155°C; Military Standard: Not; Min Operating Temperature: -55°C; Package Quantity: 5000; Packaging: Tape and Reel; Pricing 1: 1=0.1, 10=0.062, 100=0.025, 1000=0.01, 5000=0.007, 10000=0.006 (USD); Pricing 2: 1=0.1, 10=0.062, 100=0.0254, 1000=0.01142, 2500=0.00991 (USD); Radiation Hardening: No; REACH SVHC: Unknown; Stock 1: 1328419; Stock 2: 975000; Supplier 1: Mouser; Supplier 2: Digi-Key; Supplier Part Number 1: 71-CRCW0805-10K-E3; Supplier Part Number 2: 541-10.0KCDKR-ND; Termination: SMD/SMT; Tolerance: 1%; Voltage Rating: 150V; Weight: 0.000194oz; Width: 1.25mm
R53 = R1.0k_1%_1/8W_0603: RES 1.0K OHM 1/8W 1% 0603; Partnumber: MCT06030C1001FP500; Manufacturer: Vishay; Max Power Dissipation: 125mW; Power Rating: 100mW; Resistance: 1kR; Temperature Coefficient: 50ppm/°C; Voltage Rating (DC): 75V; NCM: 8533.21.20; Case/Package: 0603; Case Code (Imperial): 0603; Case Code (Metric): 1608; ComponentLink1Description: http://www.vishay.com/docs/28705/mcx0x0xpro.pdf?src-supplier=Digi-Key; ComponentLink1URL: http://www.vishay.com/docs/28705/mcx0x0xpro.pdf?src-supplier=Digi-Key; ComponentLink2Description: http://www.vishay.com/docs/28705/mc_pro.pdf?src-supplier=Avnet+Europe; ComponentLink2URL: http://www.vishay.com/docs/28705/mc_pro.pdf?src-supplier=Avnet+Europe; ComponentLink3Description: http://www.vishay.com/docs/28705/mc_pro.pdf?src-supplier=Avnet; ComponentLink3URL: http://www.vishay.com/docs/28705/mc_pro.pdf?src-supplier=Avnet; ComponentLink4Description: http://www.vishay.com/docs/28705/mc_pro.pdf?src-supplier=Future+Electronics; ComponentLink4URL: http://www.vishay.com/docs/28705/mc_pro.pdf?src-supplier=Future+Electronics; Composition: Thin Film; Contact Plating: Tin; Depth: 0.85mm; Height: 0.022inch; Lead Free: Lead Free; Length: 1.55mm; Manufacturer Part Number: MCT06030C1001FP500; Max Operating Temperature: 125°C; Military Standard: Not; Min Operating Temperature: -55°C; Mount: Surface Mount; Number of Terminations: 2; Package Quantity: 1; Packaging: Tape and Reel; Pricing 1: 1=0.1, 1000=0.025, 2000=0.023, 5000=0.019, 10000=0.018, 20000=0.017 (USD); Pricing 2: 1=0.17, 10=0.145, 100=0.0568, 1000=0.02376, 2500=0.02178 (USD); Radiation Hardening: No; REACH SVHC: Unknown; Stock 1: 142157; Stock 2: 268907; Supplier 1: Mouser; Supplier 2: Digi-Key; Supplier Part Number 1: 594-MCT06030C1001FP5; Supplier Part Number 2: MCT0603-1.00K-CFCT-ND; Termination: SMD/SMT; Tolerance: 1%; Voltage Rating: 75V; Weight: 7.1E-05oz; Width: 0.033inch
R54 = R5.9K_1%_1/8W_0805: RES 5K9 OHM 1/8W 1% 0805; Partnumber: 71-CRCW0805-5.9K-E3; Manufacturer: Vishay; Manufacturer Part Number: CRCW08055K90FKEA; Max Power Dissipation: 125mW; Resistance: 5.9kR; Temperature Coefficient: 100ppm/°C; Voltage Rating: 150V; NCM: 8533.21.20; Case/Package: 0805; Case Code (Imperial): 0805; Case Code (Metric): 2012; ComponentLink1Description: http://www.mouser.com/ds/2/427/dcrcwe3-109170.pdf?src-supplier=Mouser; ComponentLink1URL: http://www.mouser.com/ds/2/427/dcrcwe3-109170.pdf?src-supplier=Mouser; ComponentLink2Description: http://uk.rs-online.com/webdocs/0d98/0900766b80d98b26.pdf?src-supplier=RSComponents; ComponentLink2URL: http://uk.rs-online.com/webdocs/0d98/0900766b80d98b26.pdf?src-supplier=RSComponents; ComponentLink3Description: http://www.farnell.com/datasheets/2310790.pdf?src-supplier=Element14; ComponentLink3URL: http://www.farnell.com/datasheets/2310790.pdf?src-supplier=Element14; ComponentLink4Description: http://www.vishay.com/docs/20035/dcrcwe3.pdf?src-supplier=Digi-Key; ComponentLink4URL: http://www.vishay.com/docs/20035/dcrcwe3.pdf?src-supplier=Digi-Key; ComponentLink5Description: http://www.vishay.com/docs/20035/dcrcwe3.pdf?src-supplier=Avnet; ComponentLink5URL: http://www.vishay.com/docs/20035/dcrcwe3.pdf?src-supplier=Avnet; ComponentLink6Description: http://www.vishay.com/docs/20035/dcrcwe3.pdf?src-supplier=Avnet+Europe; ComponentLink6URL: http://www.vishay.com/docs/20035/dcrcwe3.pdf?src-supplier=Avnet+Europe; ComponentLink7Description: http://www.farnell.com/datasheets/1697337.pdf?src-supplier=Element14; ComponentLink7URL: http://www.farnell.com/datasheets/1697337.pdf?src-supplier=Element14; Composition: Thick Film; Contact Plating: Tin; Depth: 1.25mm; Features: Automotive AEC-Q200; Height: 0.45mm; Length: 2mm; Max Operating Temperature: 155°C; Military Standard: Not; Min Operating Temperature: -55°C; Number of Pins: 2; Number of Terminations: 2; Package Quantity: 10; Packaging: Tape and Reel; Power Rating: 125mW; Pricing 1: 1=0.1, 10=0.062, 100=0.025, 1000=0.01, 5000=0.007, 10000=0.006 (USD); Pricing 2: 1=0.1, 10=0.062, 100=0.0254, 1000=0.01142, 2500=0.00991 (USD); Radiation Hardening: No; REACH SVHC: Unknown; Stock 1: 29325; Stock 2: 19246; Supplier 1: Mouser; Supplier 2: Digi-Key; Supplier Part Number 1: 71-CRCW0805-5.9K-E3; Supplier Part Number 2: 541-5.90KCCT-ND; Termination: SMD/SMT; Tolerance: 1%; Weight: 0.000194oz; Width: 1.25mm; Working Voltage: 150V
Rsense3 = R0.075R_1%_0.5W_1206: Current Sense Resistors - SMD 1/2W 0.075 OHMS 1% 4 Terminal; Partnumber: LVK12R075FER; Manufacturer: Ohmite; Max Power Dissipation: 500mW; Resistance: 75mR; Temperature Coefficient: 50ppm/°C; NCM: 8533.21.20; Case/Package: 1206; Case Code (Imperial): 1206; Case Code (Metric): 3216; ComponentLink1Description: http://www.mouser.com/ds/2/303/res_lvk-526397.pdf?src-supplier=Mouser; ComponentLink1URL: http://www.mouser.com/ds/2/303/res_lvk-526397.pdf?src-supplier=Mouser; ComponentLink2Description: http://www.alliedelec.com/images/products/datasheets/bm/OHMITE/70585002.pdf?src-supplier=Allied+Electronics; ComponentLink2URL: http://www.alliedelec.com/images/products/datasheets/bm/OHMITE/70585002.pdf?src-supplier=Allied+Electronics; ComponentLink3Description: http://www.ohmite.com/cat/res_lvk.pdf?src-supplier=Digi-Key; ComponentLink3URL: http://www.ohmite.com/cat/res_lvk.pdf?src-supplier=Digi-Key; Composition: Thick Film; Features: Moisture Resistant; Height: 0.026inch; Length: 0.126inch; Manufacturer Part Number: LVK12R075FER; Max Operating Temperature: 125°C; Min Operating Temperature: -40°C; Number of Terminations: 4; Packaging: Tape and Reel; Pricing 1: 1=0.7, 10=0.608, 25=0.488, 100=0.422, 250=0.41, 500=0.409 (USD); Pricing 2: 1=0.92, 10=0.8 (USD); Stock 1: 1880; Stock 2: 16; Supplier 1: Mouser; Supplier 2: Digi-Key; Supplier Part Number 1: 588-LVK12R075FER; Supplier Part Number 2: LVK12R075FERCT-ND; Tolerance: 1%; Width: 0.063inch
U9 = TPS5420QDRQ1: Manufacturer: Texas Instruments; Efficiency: 95%; Max Input Voltage: 36V; Max Output Current: 2A; Max Output Voltage: 31V; Min Input Voltage: 5.5V; Min Output Voltage: 1.22V; Number of Outputs: 1; Output Type: Adjustable; Quiescent Current: 3mA; Switching Frequency: 500kHz; Synchronous Rectifier: No; Partnumber: TPS5420QDRQ1; Case/Package: SOIC; ComponentLink1Description: http://www.ti.com/general/docs/lit/getliterature.tsp?genericPartNumber=TPS5420-Q1&&fileType=pdf&src-supplier=Avnet; ComponentLink1URL: http://www.ti.com/general/docs/lit/getliterature.tsp?genericPartNumber=TPS5420-Q1&&fileType=pdf&src-supplier=Avnet; ComponentLink2Description: http://www.ti.com/lit/ds/symlink/tps5420-q1.pdf?src-supplier=Digi-Key; ComponentLink2URL: http://www.ti.com/lit/ds/symlink/tps5420-q1.pdf?src-supplier=Digi-Key; ComponentLink3Description: https://www.verical.com/server-webapp/html/getDatasheet?partID=292405&src-supplier=Verical; ComponentLink3URL: https://www.verical.com/server-webapp/html/getDatasheet?partID=292405&src-supplier=Verical; ComponentLink4Description: http://focus.ti.com/lit/ds/symlink/tps5420-q1.pdf?src-supplier=Avnet+Europe; ComponentLink4URL: http://focus.ti.com/lit/ds/symlink/tps5420-q1.pdf?src-supplier=Avnet+Europe; ComponentLink5Description: http://datasheet.iiic.cc/texas_instruments/TPS5420QDRQ1.pdf?src-supplier=IIIC; ComponentLink5URL: http://datasheet.iiic.cc/texas_instruments/TPS5420QDRQ1.pdf?src-supplier=IIIC; Lead Free: Lead Free; Manufacturer Part Number: TPS5420QDRQ1; Max Operating Temperature: 125°C; Min Operating Temperature: -40°C; Mount: Surface Mount; Number of Pins: 8; Operating Supply Voltage: 36V; Output Current: 2A; Output Voltage: 1.22V; Package Quantity: 2500; Packaging: Tape and Reel; Pricing 1: 1=3.94, 10=3.54, 25=3.35, 100=2.75, 250=2.47, 500=2.38 (USD); Pricing 2: 1=3.94, 10=3.534, 25=3.3412, 100=2.7473, 250=2.46512, 500=2.376, 1000=1.97505 (USD); Radiation Hardening: No; REACH SVHC: No SVHC; Stock 1: 3562; Stock 2: 4441; Supplier 1: Mouser; Supplier 2: Digi-Key; Supplier Part Number 1: 595-TPS5420QDRQ1; Supplier Part Number 2: 296-23226-1-ND; Weight: 0.002677oz
U27 = MAX9934TAUA+: Manufacturer: Maxim; -3db Bandwidth: 1.5kHz; Common Mode Rejection Ratio: 128dB; Input Bias Current: 35uA; Input Offset Voltage (Vos): 10uV; Max Supply Voltage: 3.6V; Min Supply Voltage: 2.5V; Nominal Supply Current: 120uA; Number of Amplifiers: 1; Partnumber: MAX9934TAUA+; Bandwidth: 1.5kHz; Case/Package: UMAX; ComponentLink1Description: https://media.digikey.com/pdf/Data%20Sheets/Maxim%20PDFs/PartNumberBreakdown_ds.pdf?src-supplier=Digi-Key; ComponentLink1URL: https://media.digikey.com/pdf/Data%20Sheets/Maxim%20PDFs/PartNumberBreakdown_ds.pdf?src-supplier=Digi-Key; Manufacturer Part Number: MAX9934TAUA+; Max Operating Temperature: 125°C; Min Operating Temperature: -40°C; Number of Circuits: 1; Number of Pins: 8; Operating Supply Current: 120uA; Package Quantity: 50; Packaging: Rail/Tube; Pricing 1: 1=2.18, 10=1.96, 25=1.85, 50=1.85, 100=1.56, 250=1.56 (USD); Pricing 2: 1=2.35, 10=2.112, 25=1.9964, 100=1.6414, 250=1.55904 (USD); Radiation Hardening: No; REACH SVHC: Unknown; Stock 1: 542; Stock 2: 2797; Supplier 1: Mouser; Supplier 2: Digi-Key; Supplier Part Number 1: 700-MAX9934TAUA; Supplier Part Number 2: MAX9934TAUA+-ND